# Altium schematic sheet ICM20608.SchDoc
size A4; SheetNumber: 7; SheetTotal: 8
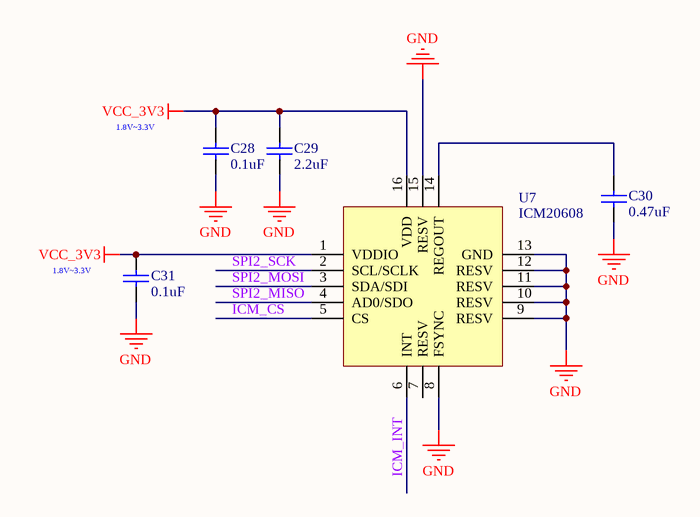
[diagram p0: ICM20608.SchDoc]

## Parts
C28  0.1uF  [C0402_L]
C29  2.2uF  [C0402_L]
C30  0.47uF  [C0402_L]
C31  0.1uF  [C0402_L]
U7  ICM20608  [LGA16     3*3*0.75]

## Nets
GND: C28.1 C29.1 C30.2 C31.2 U7.8(FSYNC) U7.9(RESV) U7.10(RESV) U7.11(RESV) U7.12(RESV) U7.13(GND) U7.15(RESV)
VCC_3V3: C28.2 C29.2 C31.1 U7.1(VDDIO) U7.16(VDD)
ICM_CS: U7.5(CS)
ICM_INT: U7.6(INT)
SPI2_MISO: U7.4(AD0/SDO)
SPI2_MOSI: U7.3(SDA/SDI)
SPI2_SCK: U7.2(SCL/SCLK)
NetC30_1: C30.1 U7.14(REGOUT)

Not connected (* = marked no-connect by the designer): U7 7(RESV)

## Notes on the sheet
- (near C28) 1.8V~3.3V
- (near C31) 1.8V~3.3V

## Library data of the parts
C28-C31 = C: 贴片电容; BOM名称: 无极性贴片电容; 联系卖家，免费查找封装: 唯一出售店铺网址https://shop463601444.taobao.com
U7 = ICM20608-G: 六轴姿态传感器